# Altium project DM1090FFC_R0M0E0.PrjPcb (part 4 of 4)

## Sheet DM1090FFC_IMU.SchDoc: =project_title
size Tabloid; CompanyName: Luxonis Holding; DrawnBy: David Malovrh; Organization: Luxonis Holding; Address1: 1925 Harmony Park Drive; Address2: Westminster, CO; Address3: 80234; Address4: United States; DocumentNumber: D0000190; Revision: R1M0E1; SheetNumber: 4; SheetTotal: 11
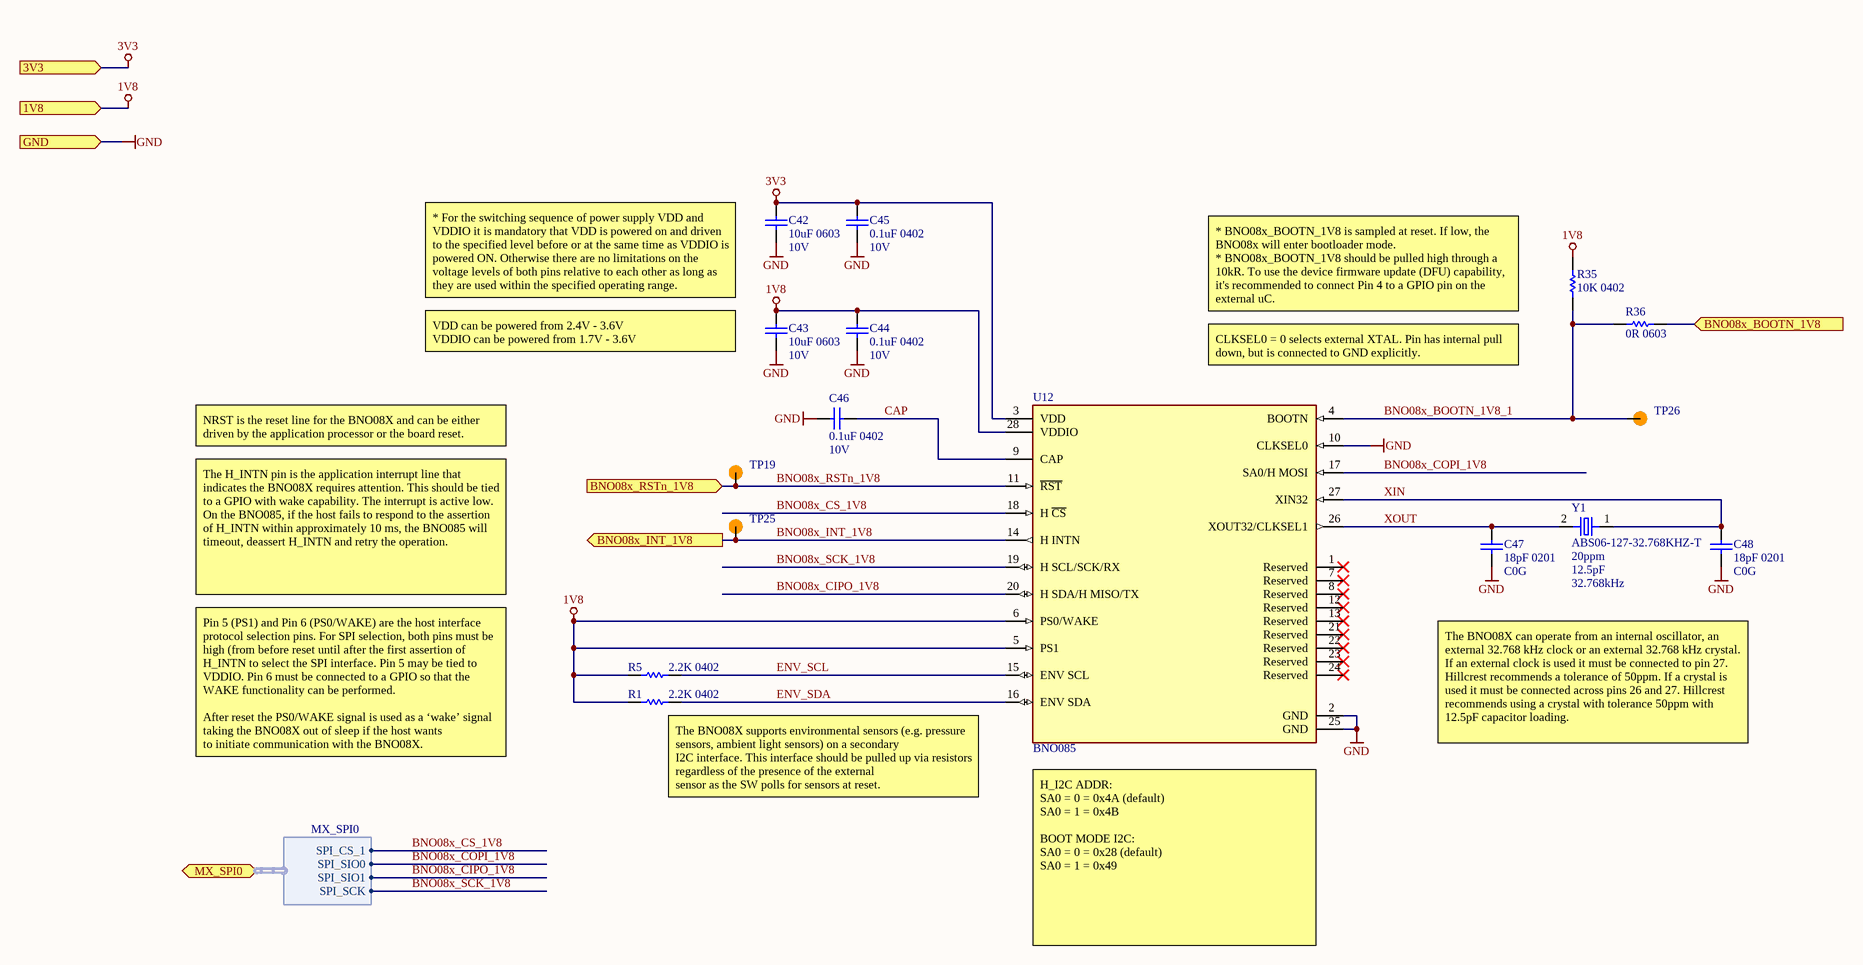
[diagram p6: DM1090FFC_IMU.SchDoc]

### Parts
C42  10uF 0603  Voltage Rating: 10V  [CAPC0603(1608)100_L]
C43  10uF 0603  Voltage Rating: 10V  [CAPC0603(1608)100_L]
C44  0.1uF 0402  Voltage Rating: 10V  [CAPC0402(1005)70_L]
C45  0.1uF 0402  Voltage Rating: 10V  [CAPC0402(1005)70_L]
C46  0.1uF 0402  Voltage Rating: 10V  [CAPC0402(1005)70_L]
C47  18pF 0201  Dielectric: C0G  [CAPC0201(0603)33_L]
C48  18pF 0201  Dielectric: C0G  [CAPC0201(0603)33_L]
R1  2.2K 0402  [RESC0402(1005)_L]
R5  2.2K 0402  [RESC0402(1005)_L]
R35  10K 0402  [RESC0402(1005)_L]
R36  0R 0603  [RESC0603(1608)_L]
TP19  TP100_200_NS  [TP100_200_NS]  (value not drawn)  (no BOM)
TP25  TP100_200_NS  [TP100_200_NS]  (value not drawn)  (no BOM)
TP26  TP100_200_NS  [TP100_200_NS]  (value not drawn)  (no BOM)
U12  BNO085  [BNO085]
Y1  ABS06-127-32.768KHZ-T  Frequency Tolerance: 20ppm  Load Capacitance: 12.5pF  Frequency: 32.768kHz  [ABS06-127-32.768KHZ-T]

### Ports
1V8 (in), 3V3 (in), BNO08x_BOOTN_1V8 (in), BNO08x_INT_1V8 (out), BNO08x_RSTn_1V8 (in), GND (in), MX_SPI0 (bidir, harness MX_SPI0)

### Harnesses
MX_SPI0: SPI_SIO0, SPI_SIO1, SPI_CS_1, SPI_SCK

### Nets
1V8: C43.2 C44.2 R1.1 R5.1 R35.2 U12.5(PS1) U12.6(PS0/WAKE) U12.28(VDDIO) ; port 1V8
3V3: C42.2 C45.2 U12.3(VDD) ; port 3V3
GND: C42.1 C43.1 C44.1 C45.1 C46.2 C47.1 C48.1 U12.2(GND) U12.10(CLKSEL0) U12.25(GND) ; port GND
BNO08x_BOOTN_1V8: R36.2 ; port BNO08x_BOOTN_1V8
BNO08x_BOOTN_1V8_1: R35.1 R36.1 TP26.1 U12.4(BOOTN)
BNO08x_CIPO_1V8: U12.20(H_SDA/H_MISO/TX) ; port MX_SPI0.SPI_SIO1
BNO08x_COPI_1V8: U12.17(SA0/H_MOSI) ; port MX_SPI0.SPI_SIO0
BNO08x_CS_1V8: U12.18(H_~{CS}) ; port MX_SPI0.SPI_CS_1
BNO08x_INT_1V8: TP25.1 U12.14(H_INTN) ; port BNO08x_INT_1V8
BNO08x_RSTn_1V8: TP19.1 U12.11(~{RST}) ; port BNO08x_RSTn_1V8
BNO08x_SCK_1V8: U12.19(H_SCL/SCK/RX) ; port MX_SPI0.SPI_SCK
CAP: C46.1 U12.9(CAP)
ENV_SCL: R5.2 U12.15(ENV_SCL)
ENV_SDA: R1.2 U12.16(ENV_SDA)
XIN: C48.2 U12.27(XIN32) Y1.1
XOUT: C47.2 U12.26(XOUT32/CLKSEL1) Y1.2

Not connected (* = marked no-connect by the designer): U12 1(Reserved)* 7(Reserved)* 8(Reserved)* 12(Reserved)* 13(Reserved)* 21(Reserved)* 22(Reserved)* 23(Reserved)* 24(Reserved)*

### Notes on the sheet
- * For the switching sequence of power supply VDD and VDDIO it is mandatory that VDD is powered on and driven to the specified level before or at the same time as VDDIO is powered ON. Otherwise there are no limitations on the voltage levels of both pins relative to each other as long as they are used within the specified operating range.
- (near C43) VDD can be powered from 2.4V - 3.6V
  VDDIO can be powered from 1.7V - 3.6V
- * BNO08x_BOOTN_1V8 is sampled at reset. If low, the BNO08x will enter bootloader mode.
  * BNO08x_BOOTN_1V8 should be pulled high through a 10kR. To use the device firmware update (DFU) capability, it's recommended to connect Pin 4 to a GPIO pin on the external uC.
- CLKSEL0 = 0 selects external XTAL. Pin has internal pull down, but is connected to GND explicitly.
- NRST is the reset line for the BNO08X and can be either driven by the application processor or the board reset.
- The H_INTN pin is the application interrupt line that indicates the BNO08X requires attention. This should be tied to a GPIO with wake capability. The interrupt is active low. On the BNO085, if the host fails to respond to the assertion of H_INTN within approximately 10 ms, the BNO085 will timeout, deassert H_INTN and retry the operation.
- Pin 5 (PS1) and Pin 6 (PS0/WAKE) are the host interface protocol selection pins. For SPI selection, both pins must be high (from before reset until after the first assertion of H_INTN to select the SPI interface. Pin 5 may be tied to VDDIO. Pin 6 must be connected to a GPIO so that the WAKE functionality can be performed.
  After reset the PS0/WAKE signal is used as a ‘wake’ signal taking the BNO08X out of sleep if the host wants
  to initiate communication with the BNO08X.
- The BNO08X can operate from an internal oscillator, an external 32.768 kHz clock or an external 32.768 kHz crystal. If an external clock is used it must be connected to pin 27. Hillcrest recommends a tolerance of 50ppm. If a crystal is used it must be connected across pins 26 and 27. Hillcrest recommends using a crystal with tolerance 50ppm with 12.5pF capacitor loading.
- (near R1) The BNO08X supports environmental sensors (e.g. pressure sensors, ambient light sensors) on a secondary
  I2C interface. This interface should be pulled up via resistors regardless of the presence of the external
  sensor as the SW polls for sensors at reset.
- (near U12) H_I2C ADDR:
  SA0 = 0 = 0x4A (default)
  SA0 = 1 = 0x4B
  BOOT MODE I2C:
  SA0 = 0 = 0x28 (default)
  SA0 = 1 = 0x49
- Title
- Size:
- Date:
- Tabloid
- Number:
- Time:
- Revision:
- Sheet
- of
- Drawn by:

### Library data of the parts
C42 C43 = GRM188R61A106ME69D: CAP CER 10UF 10V X5R 0603 20%; Manufacturer 1: Murata; Material: Ceramic; Supplier 1: Digi-Key; Manufacturer Part Number 1: GRM188R61A106ME69D; Stock 1: 2873098; Pricing 1: 1=0.21000, 10=0.14100, 100=0.07130, 500=0.04876, 1000=0.04313 (USD); RoHS: Yes; Mount: Surface Mount; Case/Package: 0603; Weight: 0.000222oz; Case Code (Metric): 1608; Case Code (Imperial): 0603; Min Operating Temperature: -55°C; Max Operating Temperature: 85°C; Packaging: Tape and Reel; Tolerance: 20%; Capacitance: 10uF; Dielectric: X5R; Voltage Rating (DC): 10V; Package Quantity: 4000; Termination: SMD/SMT; Length: 1.6mm; Height: 0.8mm; Width: 0.8mm; Thickness: 0.035inch; Depth: 0.8mm; REACH SVHC: Unknown; Lead Free: Lead Free; ComponentLink1URL: http://www.mouser.com/ds/2/281/c02e-2905.pdf?src-supplier=Mouser; ComponentLink1Description: http://www.mouser.com/ds/2/281/c02e-2905.pdf?src-supplier=Mouser; ComponentLink2URL: http://components.arrow.com/part/dataview/0323_06119472?src-supplier=Arrow+Europe; ComponentLink2Description: http://components.arrow.com/part/dataview/0323_06119472?src-supplier=Arrow+Europe; ComponentLink3URL: http://www.farnell.com/datasheets/2048014.pdf?src-supplier=Farnell; ComponentLink3Description: http://www.farnell.com/datasheets/2048014.pdf?src-supplier=Farnell; ComponentLink4URL: http://www.farnell.com/datasheets/1872210.pdf?src-supplier=Farnell; ComponentLink4Description: http://www.farnell.com/datasheets/1872210.pdf?src-supplier=Farnell; ComponentLink5URL: http://search.murata.co.jp/Ceramy/image/img/A01X/G101/ENG/GRM188R61A106ME69-01.pdf?src-supplier=Digi-Key; ComponentLink5Description: http://search.murata.co.jp/Ceramy/image/img/A01X/G101/ENG/GRM188R61A106ME69-01.pdf?src-supplier=Digi-Key; ComponentLink6URL: http://www.farnell.com/datasheets/1872210.pdf?src-supplier=Newark; ComponentLink6Description: http://www.farnell.com/datasheets/1872210.pdf?src-supplier=Newark; ComponentLink7URL: http://www.farnell.com/datasheets/2048014.pdf?src-supplier=Element14; ComponentLink7Description: http://www.farnell.com/datasheets/2048014.pdf?src-supplier=Element14; ComponentLink8URL: http://www.farnell.com/datasheets/2048014.pdf?src-supplier=Newark; ComponentLink8Description: http://www.farnell.com/datasheets/2048014.pdf?src-supplier=Newark; Supplier Part Number 1: 490-10475-1-ND
C44-C46 = GRM155R71A104JA01D: CAP CER 0.1UF 10V X7R 0402 5%; Manufacturer 1: Murata; Capacitance: 100nF; Supplier 1: Digi-Key; Manufacturer Part Number 1: GRM155R71A104JA01D; Stock 1: 1346709; Pricing 1: 1=0.10000, 10=0.02500, 100=0.01130, 500=0.00806, 1000=0.00633, 2500=0.00575, 5000=0.00529 (USD); RoHS: Yes; Mount: Surface Mount; Case/Package: 0402; Case Code (Imperial): 0402; Case Code (Metric): 1005; Min Operating Temperature: -55°C; Max Operating Temperature: 125°C; Tolerance: 5%; Packaging: Tape and Reel; Voltage Rating (DC): 10V; Dielectric: X7R; Package Quantity: 10000; Termination: SMD/SMT; Length: 1mm; Height: 0.5mm; Width: 0.02inch; Thickness: 0.022inch; Depth: 0.5mm; Radiation Hardening: No; Lead Free: Lead Free; ComponentLink1URL: https://datasheet.ciiva.com/5411/product-5411135.pdf?src-supplier=Mouser; ComponentLink1Description: https://datasheet.ciiva.com/5411/product-5411135.pdf?src-supplier=Mouser; ComponentLink2URL: https://datasheet.ciiva.com/11618/c02e-11618821.pdf?src-supplier=Avnet; ComponentLink2Description: https://datasheet.ciiva.com/11618/c02e-11618821.pdf?src-supplier=Avnet; Supplier Part Number 1: 490-10777-1-ND
C47 C48 = GRM0335C1E180FA01D: Cap Ceramic 18pF 25V C0G 1% Pad SMD 0201 125C T/R; Manufacturer 1: Murata; Supplier 1: Digi-Key; Manufacturer Part Number 1: GRM0335C1E180FA01D; RoHS: Yes; Category: Ceramic Capacitors; Stock 1: 27511; Pricing 1: 1=0.10000, 10=0.02100, 100=0.00930, 500=0.00666, 1000=0.00523, 2500=0.00476, 5000=0.00438 (USD); Mount: Surface Mount; Case/Package: 0201; Case Code (Imperial): 0201; Case Code (Metric): 0603; Min Operating Temperature: -55°C; Max Operating Temperature: 125°C; Capacitance: 18pF; Tolerance: 1%; Packaging: Tape and Reel; Voltage Rating (DC): 25V; Package Quantity: 15000; Voltage Rating: 25V; Termination: SMD/SMT; Length: 0.024inch; Height: 0.3mm; Thickness: 0.013inch; Width: 0.3mm; ComponentLink1URL: https://datasheet.ciiva.com/29538/partnumbering-e-01-29538328.pdf?src-supplier=Digi-Key; ComponentLink1Description: https://datasheet.ciiva.com/29538/partnumbering-e-01-29538328.pdf?src-supplier=Digi-Key; Supplier 2: Digi-Key; Supplier 3: Mouser; Supplier Part Number 3: 81-GRM0335C1E180FA1D; Supplier Part Number 2: 490-17804-2-ND; Supplier Part Number 1: 490-17804-1-ND
R1 R5 = RC0402FR-072K2L: RES SMD 2.2K OHM 1% 1/16W 0402; Manufacturer 1: Yageo; Resistance: 2.2kR; Temperature Coefficient: 100ppm/°C; Power Rating: 63mW; Voltage Rating: 50V; Supplier 1: Digi-Key; Manufacturer Part Number 1: RC0402FR-072K2L; Stock 1: 12579098; Pricing 1: 1=0.10000, 10=0.01600, 100=0.00640, 1000=0.00289, 2500=0.00251, 5000=0.00207 (USD); RoHS: Yes; Case/Package: 0402; Weight: 2.3E-05oz; Case Code (Imperial): 0402; Case Code (Metric): 1005; Min Operating Temperature: -55°C; Max Operating Temperature: 155°C; Packaging: Tape and Reel; Tolerance: 1%; Composition: Thick Film; Termination: SMD/SMT; Military Standard: Not; Length: 1mm; Height: 0.35mm; Width: 0.5mm; Depth: 0.5mm; Lead Free: Lead Free; REACH SVHC: Unknown; ComponentLink1URL: https://datasheet.ciiva.com/11808/0900766b80c66297-11808786.pdf?src-supplier=RSComponents; ComponentLink1Description: https://datasheet.ciiva.com/11808/0900766b80c66297-11808786.pdf?src-supplier=RSComponents; ComponentLink2URL: https://datasheet.ciiva.com/12577/pyu-rc0402-51-rohs-l-6-r-12577429.pdf?src-supplier=Mouser; ComponentLink2Description: https://datasheet.ciiva.com/12577/pyu-rc0402-51-rohs-l-6-r-12577429.pdf?src-supplier=Mouser; ComponentLink3URL: https://datasheet.ciiva.com/16741/pyu-rc0402-51-rohs-l-6-r-16741015.pdf?src-supplier=Future+Electronics; ComponentLink3Description: https://datasheet.ciiva.com/16741/pyu-rc0402-51-rohs-l-6-r-16741015.pdf?src-supplier=Future+Electronics; ComponentLink4URL: https://datasheet.ciiva.com/7983/1018594-7983515.pdf?src-supplier=Element14; ComponentLink4Description: https://datasheet.ciiva.com/7983/1018594-7983515.pdf?src-supplier=Element14; ComponentLink5URL: https://datasheet.ciiva.com/46383/1018594-46383563.pdf?src-supplier=Element14; ComponentLink5Description: https://datasheet.ciiva.com/46383/1018594-46383563.pdf?src-supplier=Element14; ComponentLink6URL: https://datasheet.ciiva.com/7849/1018594-7849928.pdf?src-supplier=Element14; ComponentLink6Description: https://datasheet.ciiva.com/7849/1018594-7849928.pdf?src-supplier=Element14; ComponentLink7URL: https://datasheet.ciiva.com/7849/1018594-7849929.pdf?src-supplier=Element14; ComponentLink7Description: https://datasheet.ciiva.com/7849/1018594-7849929.pdf?src-supplier=Element14; Supplier 2: Mouser; Supplier 3: Newark; Supplier Part Number 1: 311-2.20KLRCT-ND; Supplier Part Number 2: 603-RC0402FR-072K2L; Supplier Part Number 3: 98K7523
R35 = RC0402FR-1310KL: RES SMD 10K OHM 1% 0402 1/16W Chip Resistor, 0402 [1005 Metric], 10 kohm, RC Series, 50 V, Thick Film, 62.5 mW; Manufacturer 1: Yageo; Resistance: 10kR; Temperature Coefficient: 100ppm/°C; Power Rating: 62.5mW; Voltage Rating: 50V; ComponentLink1URL: https://datasheet.ciiva.com/16940/pyu-rc0402-51-rohs-l-6-16940293.pdf?src-supplier=Avnet+Europe; ComponentLink1Description: https://datasheet.ciiva.com/16940/pyu-rc0402-51-rohs-l-6-16940293.pdf?src-supplier=Avnet+Europe; ComponentLink2URL: https://datasheet.ciiva.com/28386/pyu-rc0402-51-rohs-l-6-28386855.pdf?src-supplier=Avnet+Europe; ComponentLink2Description: https://datasheet.ciiva.com/28386/pyu-rc0402-51-rohs-l-6-28386855.pdf?src-supplier=Avnet+Europe; ComponentLink3URL: https://datasheet.ciiva.com/16740/pyu-rc0402-51-rohs-l-6-r-16740602.pdf?src-supplier=Future+Electronics; ComponentLink3Description: https://datasheet.ciiva.com/16740/pyu-rc0402-51-rohs-l-6-r-16740602.pdf?src-supplier=Future+Electronics; ComponentLink4URL: https://datasheet.ciiva.com/8891/pyu-rc0402-51-rohs-l-6-8891339.pdf?src-supplier=Avnet; ComponentLink4Description: https://datasheet.ciiva.com/8891/pyu-rc0402-51-rohs-l-6-8891339.pdf?src-supplier=Avnet; ComponentLink5URL: https://datasheet.ciiva.com/5557/pyu-rc0402-51-rohs-l-6-r-5557997.pdf?src-supplier=Mouser; ComponentLink5Description: https://datasheet.ciiva.com/5557/pyu-rc0402-51-rohs-l-6-r-5557997.pdf?src-supplier=Mouser; ComponentLink6URL: https://datasheet.ciiva.com/7983/1018594-7983533.pdf?src-supplier=Element14; ComponentLink6Description: https://datasheet.ciiva.com/7983/1018594-7983533.pdf?src-supplier=Element14; Supplier 1: Newark; Manufacturer Part Number 1: RC0402FR-1310KL; Stock 1: 62239; Pricing 1: 1=0.10000, 25=0.01200, 100=0.00400, 250=0.00400, 500=0.00300, 1000=0.00300 (USD); RoHS: Yes; Case/Package: 0402; Number of Pins: 2; Contact Plating: Tin,Matte,Lead; Case Code (Imperial): 0402; Case Code (Metric): 1005; Min Operating Temperature: -55°C; Max Operating Temperature: 155°C; Tolerance: 1%; Composition: Thick Film; Packaging: Tape and Reel; Termination: SMD/SMT; Military Standard: Not; Voltage Rating (DC): 50V; Working Voltage: 50V; Number of Terminations: 2; Length: 1mm; Depth: 0.5mm; Radiation Hardening: No; REACH SVHC: No SVHC; Lead Free: Lead Free; Supplier Part Number 1: 67R9960; Supplier 2: Future Electronics; Supplier 3: Mouser; Supplier 4: Element14; Supplier Part Number 2: RC0402FR-1310KL-CUTT; Supplier Part Number 3: 603-RC0402FR-1310KL; Supplier Part Number 4: 1799235
R36 = CRCW06030000Z0EA: RES SMD 0 OHM JUMPER 1/10W 0603 0 Ohms Jumper 0.1W, 1/10W Chip Resistor 0603 (1608 Metric) Automotive AEC-Q200 Thick Film; Manufacturer 1: Vishay; Manufacturer Part Number 1: CRCW0603-0000Z0EA; Resistance: 0mR; Power Rating: 100mW; Voltage Rating: 75V; Temperature Coefficient: 100ppm/°C; Tolerance: 5%; Current Rating: 2A; Supplier 1: Digi-Key; Stock 1: 742743; Pricing 1: 1=0.100000, 10=0.034000, 25=0.024400, 50=0.018600, 100=0.013800, 250=0.010480, 500=0.008400, 1000=0.006180 (USD); RoHS: Yes; Mount: Surface Mount; Case/Package: 0603; Weight: 7.1E-05oz; Contact Plating: Tin,Lead; Case Code (Metric): 1608; Case Code (Imperial): 0603; Min Operating Temperature: -55°C; Max Operating Temperature: 155°C; Composition: Thick Film; Termination: SMD/SMT; Packaging: Tape and Reel; Package Quantity: 1; Number of Terminations: 2; Military Standard: Not; Max Power Dissipation: 100mW; Voltage Rating (DC): 75V; Features: Automotive AEC-Q200; Working Voltage: 75V; Length: 1.55mm; Height: 0.02inch; Width: 0.033inch; Depth: 0.85mm; Radiation Hardening: No; Lead Free: Lead Free; REACH SVHC: Unknown; ComponentLink1URL: https://datasheet.ciiva.com/2461/dcrcwe3-2461968.pdf?src-supplier=Digi-Key; ComponentLink1Description: https://datasheet.ciiva.com/2461/dcrcwe3-2461968.pdf?src-supplier=Digi-Key; ComponentLink2URL: https://datasheet.ciiva.com/2461/dcrcwe3-2461969.pdf?src-supplier=Digi-Key; ComponentLink2Description: https://datasheet.ciiva.com/2461/dcrcwe3-2461969.pdf?src-supplier=Digi-Key; ComponentLink3URL: https://datasheet.ciiva.com/2461/dcrcwe3-2461970.pdf?src-supplier=Digi-Key; ComponentLink3Description: https://datasheet.ciiva.com/2461/dcrcwe3-2461970.pdf?src-supplier=Digi-Key; ComponentLink4URL: https://datasheet.ciiva.com/8340/dcrcwe3-8340197.pdf?src-supplier=Avnet; ComponentLink4Description: https://datasheet.ciiva.com/8340/dcrcwe3-8340197.pdf?src-supplier=Avnet; ComponentLink5URL: https://datasheet.ciiva.com/16941/dcrcw-16941302.pdf?src-supplier=Avnet+Europe; ComponentLink5Description: https://datasheet.ciiva.com/16941/dcrcw-16941302.pdf?src-supplier=Avnet+Europe; ComponentLink6URL: https://datasheet.ciiva.com/16199/dcrcwe3-16199063.pdf?src-supplier=Future+Electronics; ComponentLink6Description: https://datasheet.ciiva.com/16199/dcrcwe3-16199063.pdf?src-supplier=Future+Electronics; ComponentLink7URL: https://datasheet.ciiva.com/16725/70201119-16725175.pdf?src-supplier=Allied+Electronics; ComponentLink7Description: https://datasheet.ciiva.com/16725/70201119-16725175.pdf?src-supplier=Allied+Electronics; ComponentLink8URL: https://datasheet.ciiva.com/26316/fld-crcw-e3-data-en-26316615.pdf?src-supplier=Distrelec; ComponentLink8Description: https://datasheet.ciiva.com/26316/fld-crcw-e3-data-en-26316615.pdf?src-supplier=Distrelec; ComponentLink9URL: https://datasheet.ciiva.com/5544/dcrcwe3-109170-5544344.pdf?src-supplier=Mouser; ComponentLink9Description: https://datasheet.ciiva.com/5544/dcrcwe3-109170-5544344.pdf?src-supplier=Mouser; ComponentLink10URL: https://datasheet.ciiva.com/7841/1720486-7841816.pdf?src-supplier=Element14; ComponentLink10Description: https://datasheet.ciiva.com/7841/1720486-7841816.pdf?src-supplier=Element14; ComponentLink11URL: https://datasheet.ciiva.com/7841/1720486-7841817.pdf?src-supplier=Element14; ComponentLink11Description: https://datasheet.ciiva.com/7841/1720486-7841817.pdf?src-supplier=Element14; ComponentLink12URL: https://datasheet.ciiva.com/7841/125364-7841818.pdf?src-supplier=Element14; ComponentLink12Description: https://datasheet.ciiva.com/7841/125364-7841818.pdf?src-supplier=Element14; ComponentLink13URL: https://datasheet.ciiva.com/16721/70201119-16721450.pdf?src-supplier=Allied+Electronics; ComponentLink13Description: https://datasheet.ciiva.com/16721/70201119-16721450.pdf?src-supplier=Allied+Electronics; Supplier Part Number 1: 541-0.0GCT-ND
TP19 TP25 TP26 = TEST_POINT
U12 = BNO085: IMU ACCEL/GYRO/MAG I2C 32BIT; Manufacturer 1: Hillcrest Laboratories; Sensor Type: Accelerometer,Gyroscope,Magnetometer; Output Type: SPI,I2C; Supplier 1: Digi-Key; Manufacturer Part Number 1: BNO085; RoHS: No; Category: Inertial Measurement Units (IMUs); Stock 1: 11593; Pricing 1: 1=11.85000, 5=10.31200, 10=9.28100, 25=8.25000, 50=7.63120, 100=6.60000, 500=6.18750, 1000=5.77500 (USD); Mount: Surface Mount; Case/Package: LGA; Min Operating Temperature: -40°C; Max Operating Temperature: 85°C; Packaging: Tape and Reel; ComponentLink1URL: https://www.hillcrestlabs.com/downloads/bno080-datasheet?src-supplier=Digi-Key; ComponentLink1Description: https://www.hillcrestlabs.com/downloads/bno080-datasheet?src-supplier=Digi-Key; ComponentLink2URL: https://www.hillcrestlabs.com/downloads/bno080-migration-guide?src-supplier=Digi-Key; ComponentLink2Description: https://www.hillcrestlabs.com/downloads/bno080-migration-guide?src-supplier=Digi-Key; Supplier Part Number 1: 1888-1006-1-ND
Y1 = ABS06-127-32.768KHZ-T: CRYSTAL 32.768kHz ±20ppm Crystal 12.5pF 90 kOhms 2-SMD, No Lead; Manufacturer 1: Abracon; ESR (Equivalent Series Resistance): 90kR; Supplier 1: Digi-Key; Manufacturer Part Number 1: ABS06-127-32.768KHZ-T; RoHS: Yes; Stock 1: 1640; Pricing 1: 1=0.69000, 10=0.60700, 50=0.56760, 100=0.50160, 500=0.47520, 1000=0.39600 (USD); Mount: Surface Mount; Case/Package: SMD/SMT; Min Operating Temperature: -40°C; Max Operating Temperature: 85°C; Packaging: Tape and Reel; ComponentLink1URL: http://www.farnell.com/datasheets/2614114.pdf?src-supplier=Farnell; ComponentLink1Description: http://www.farnell.com/datasheets/2614114.pdf?src-supplier=Farnell; ComponentLink2URL: https://abracon.com/datasheets/ABS06-127-32.768kHz-T.pdf?src-supplier=Digi-Key; ComponentLink2Description: https://abracon.com/datasheets/ABS06-127-32.768kHz-T.pdf?src-supplier=Digi-Key; ComponentLink3URL: http://www.farnell.com/datasheets/2614114.pdf?src-supplier=Newark; ComponentLink3Description: http://www.farnell.com/datasheets/2614114.pdf?src-supplier=Newark; Supplier 2: Digi-Key; Supplier 3: Mouser; Supplier 4: Verical; Supplier Part Number 1: 535-14513-1-ND; Supplier Part Number 2: 535-14513-6-ND; Supplier Part Number 3: 815-ABS0612732.768KT; Supplier Part Number 4: ABS06-127-32.768KHZ-T

## Nets that join several sheets
1V8: DM1090FFC_Connector (B2.1), DM1090FFC_Power_Supply (C7.2 TP8.1 U4.5), DM1090FFC_IMU (8 pins)
3V3: DM1090FFC_USB (7 pins), DM1090FFC_MIPI_CAM (6 pins), DM1090FFC_Power_Supply (C2.1 L1.2 R2.2), DM1090FFC_IMU (C42.2 C45.2 U12.3)
GND: DM1090FFC_TopLevel (8 pins), DM1090FFC_Connector (44 pins), DM1090FFC_USB (24 pins), DM1090FFC_MIPI_CAM (42 pins), DM1090FFC_Power_Supply (22 pins), DM1090FFC_IMU (10 pins)
VBUS: DM1090FFC_Connector (J1.53), DM1090FFC_USB (10 pins), DM1090FFC_Power_Supply (U2.3 U3.1)
VDD_5V: DM1090FFC_Connector (12 pins), DM1090FFC_USB (C76.2 R213.2 R214.2 U62.12), DM1090FFC_Power_Supply (12 pins)
BNO08x_BOOTN_1V8: DM1090FFC_Connector (J1.4), DM1090FFC_IMU (R36.2)
BNO08x_CIPO_1V8: DM1090FFC_Connector (J1.64 J5.4), DM1090FFC_IMU (U12.20)
BNO08x_COPI_1V8: DM1090FFC_Connector (J1.62 J5.2), DM1090FFC_IMU (U12.17)
BNO08x_CS_1V8: DM1090FFC_Connector (J1.60 J5.7), DM1090FFC_IMU (U12.18)
BNO08x_INT_1V8: DM1090FFC_Connector (J1.69), DM1090FFC_IMU (TP25.1 U12.14)
BNO08x_RSTn_1V8: DM1090FFC_Connector (J1.6), DM1090FFC_IMU (TP19.1 U12.11)
BNO08x_SCK_1V8: DM1090FFC_Connector (J1.74 J5.1), DM1090FFC_IMU (U12.19)
CAM_A_CLK_OUT: DM1090FFC_Connector (J1.28), DM1090FFC_MIPI_CAM (D10.5 D10.6 J6.18 TP4.1)
CAM_A_PWDN_N: DM1090FFC_Connector (J1.34), DM1090FFC_MIPI_CAM (D10.4 D10.7 J6.17 TP3.1)
CAM_B_PWDN_N: DM1090FFC_Connector (J1.67), DM1090FFC_MIPI_CAM (D7.4 D7.7 J8.17 TP1.1)
CAM_C_D_PWM: DM1090FFC_Connector (J1.65), DM1090FFC_MIPI_CAM (D11.4 D11.7 J9.17 TP13.1)
CAM_L_C_N: DM1090FFC_Connector (J1.95), DM1090FFC_MIPI_CAM (D7.1 D7.10 J8.8)
CAM_L_C_P: DM1090FFC_Connector (J1.97), DM1090FFC_MIPI_CAM (D7.2 D7.9 J8.9)
CAM_L_D0_N: DM1090FFC_Connector (J1.89), DM1090FFC_MIPI_CAM (D5.1 D5.10 J8.2)
CAM_L_D0_P: DM1090FFC_Connector (J1.91), DM1090FFC_MIPI_CAM (D5.2 D5.9 J8.3)
CAM_L_D1_N: DM1090FFC_Connector (J1.83), DM1090FFC_MIPI_CAM (D5.4 D5.7 J8.5)
CAM_L_D1_P: DM1090FFC_Connector (J1.85), DM1090FFC_MIPI_CAM (D5.5 D5.6 J8.6)
CAM_R_C_N: DM1090FFC_Connector (J1.96), DM1090FFC_MIPI_CAM (D11.1 D11.10 J9.8)
CAM_R_C_P: DM1090FFC_Connector (J1.98), DM1090FFC_MIPI_CAM (D11.2 D11.9 J9.9)
CAM_R_D0_N: DM1090FFC_Connector (J1.90), DM1090FFC_MIPI_CAM (D9.1 D9.10 J9.2)
CAM_R_D0_P: DM1090FFC_Connector (J1.92), DM1090FFC_MIPI_CAM (D9.2 D9.9 J9.3)
CAM_R_D1_N: DM1090FFC_Connector (J1.84), DM1090FFC_MIPI_CAM (D9.4 D9.7 J9.5)
CAM_R_D1_P: DM1090FFC_Connector (J1.86), DM1090FFC_MIPI_CAM (D9.5 D9.6 J9.6)
CAM_ST_CLK_OUT: DM1090FFC_Connector (J1.73), DM1090FFC_MIPI_CAM (8 pins)
COM_AUX_IO2: DM1090FFC_Connector (J1.42), DM1090FFC_MIPI_CAM (R14.1)
I2C1_SCL: DM1090FFC_Connector (J1.35), DM1090FFC_MIPI_CAM (J6.20)
I2C1_SDA: DM1090FFC_Connector (J1.33), DM1090FFC_MIPI_CAM (J6.21)
I2C2_SCL: DM1090FFC_Connector (J1.77), DM1090FFC_MIPI_CAM (J8.20 J9.20)
I2C2_SDA: DM1090FFC_Connector (J1.79), DM1090FFC_MIPI_CAM (J8.21 J9.21)
MIPI_C_N: DM1090FFC_Connector (J1.3), DM1090FFC_MIPI_CAM (D8.1 D8.10 J6.8)
MIPI_C_P: DM1090FFC_Connector (J1.5), DM1090FFC_MIPI_CAM (D8.2 D8.9 J6.9)
MIPI_D0_N: DM1090FFC_Connector (J1.9), DM1090FFC_MIPI_CAM (D6.1 D6.10 J6.2)
MIPI_D0_P: DM1090FFC_Connector (J1.11), DM1090FFC_MIPI_CAM (D6.2 D6.9 J6.3)
MIPI_D1_N: DM1090FFC_Connector (J1.15), DM1090FFC_MIPI_CAM (D6.4 D6.7 J6.5)
MIPI_D1_P: DM1090FFC_Connector (J1.17), DM1090FFC_MIPI_CAM (D6.5 D6.6 J6.6)
MIPI_D2_N: DM1090FFC_Connector (J1.21), DM1090FFC_MIPI_CAM (D8.4 D8.7 J6.11)
MIPI_D2_P: DM1090FFC_Connector (J1.23), DM1090FFC_MIPI_CAM (D8.5 D8.6 J6.12)
MIPI_D3_N: DM1090FFC_Connector (J1.27), DM1090FFC_MIPI_CAM (D10.1 D10.10 J6.14)
MIPI_D3_P: DM1090FFC_Connector (J1.29), DM1090FFC_MIPI_CAM (D10.2 D10.9 J6.15)
USB_D_N: DM1090FFC_Connector (J1.18), DM1090FFC_USB (J14.A7 J14.B7)
USB_D_P: DM1090FFC_Connector (J1.16), DM1090FFC_USB (J14.A6 J14.B6)
USB_RX_N: DM1090FFC_Connector (J1.12), DM1090FFC_USB (U61.4)
USB_RX_P: DM1090FFC_Connector (J1.10), DM1090FFC_USB (U61.3)
USB_TX_N: DM1090FFC_Connector (J1.24), DM1090FFC_USB (U61.8)
USB_TX_P: DM1090FFC_Connector (J1.22), DM1090FFC_USB (U61.7)

## Assembly variants
Production: not fitted J3 J4 J5 MISC1 RZ28 RZ29